# EAGLE schematic untitled (EAGLE 6.4)
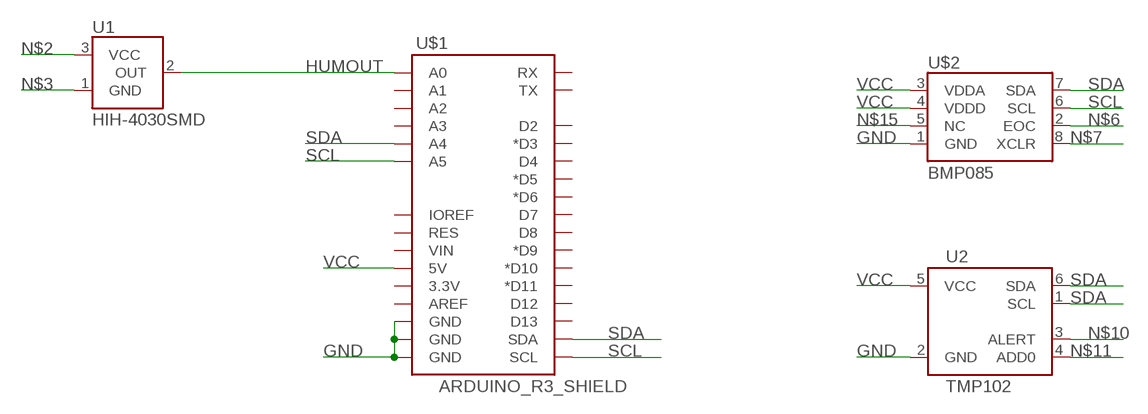
[diagram p0: schematic, sheet 1]

## Parts
U1  HIH-4030SMD  [HIH-4030]
U2  TMP102  [SOT563]
U$1  ARDUINO_R3_SHIELD  [UNO_R3_SHIELD]
U$2  BMP085  [BMP085]

## Nets
GND: U2.2(GND) U$1.GND@0(GND) U$1.GND@1(GND) U$1.GND@2(GND) U$2.1(GND)
HUMOUT: U1.2(OUT) U$1.A0
N$2: U1.3(VCC)
N$3: U1.1(GND)
N$6: U$2.2(EOC)
N$7: U$2.8(XCLR)
N$10: U2.3(ALERT)
N$11: U2.4(ADD0)
N$15: U$2.5(NC)
SCL: U$1.A5 U$1.SCL U$2.6(SCL)
SDA: U2.1(SCL) U2.6(SDA) U$1.A4 U$1.SDA U$2.7(SDA)
VCC: U2.5(VCC) U$1.5V U$2.3(VDDA) U$2.4(VDDD)
Unconnected: U$1.3.3V U$1.A1 U$1.A2 U$1.A3 U$1.AREF U$1.D2 U$1.D3(*D3) U$1.D4 U$1.D5(*D5) U$1.D6(*D6) U$1.D7 U$1.D8 U$1.D9(*D9) U$1.D10(*D10) U$1.D11(*D11) U$1.D12 U$1.D13 U$1.IOREF U$1.RES U$1.RX U$1.TX U$1.VIN

## Library data of the parts
U1 = SparkFun-Sensors:HIH-4030: Humidity Sensor
U2 = SparkFun-Sensors:TMP102: I2C degC temp sensor
U$1 = SparkFun-Boards:ARDUINO_R3_SHIELD: Shield form compatible with the Arduino Uno R3.
U$2 = SparkFun-Sensors:BMP085: BMP085 Pressure Sensor Great little MEMS pressure sensor. SKU: COM-09603